# Altium schematic sheet motherboard.SchDoc
size A3; SheetNumber: 1; SheetTotal: 1
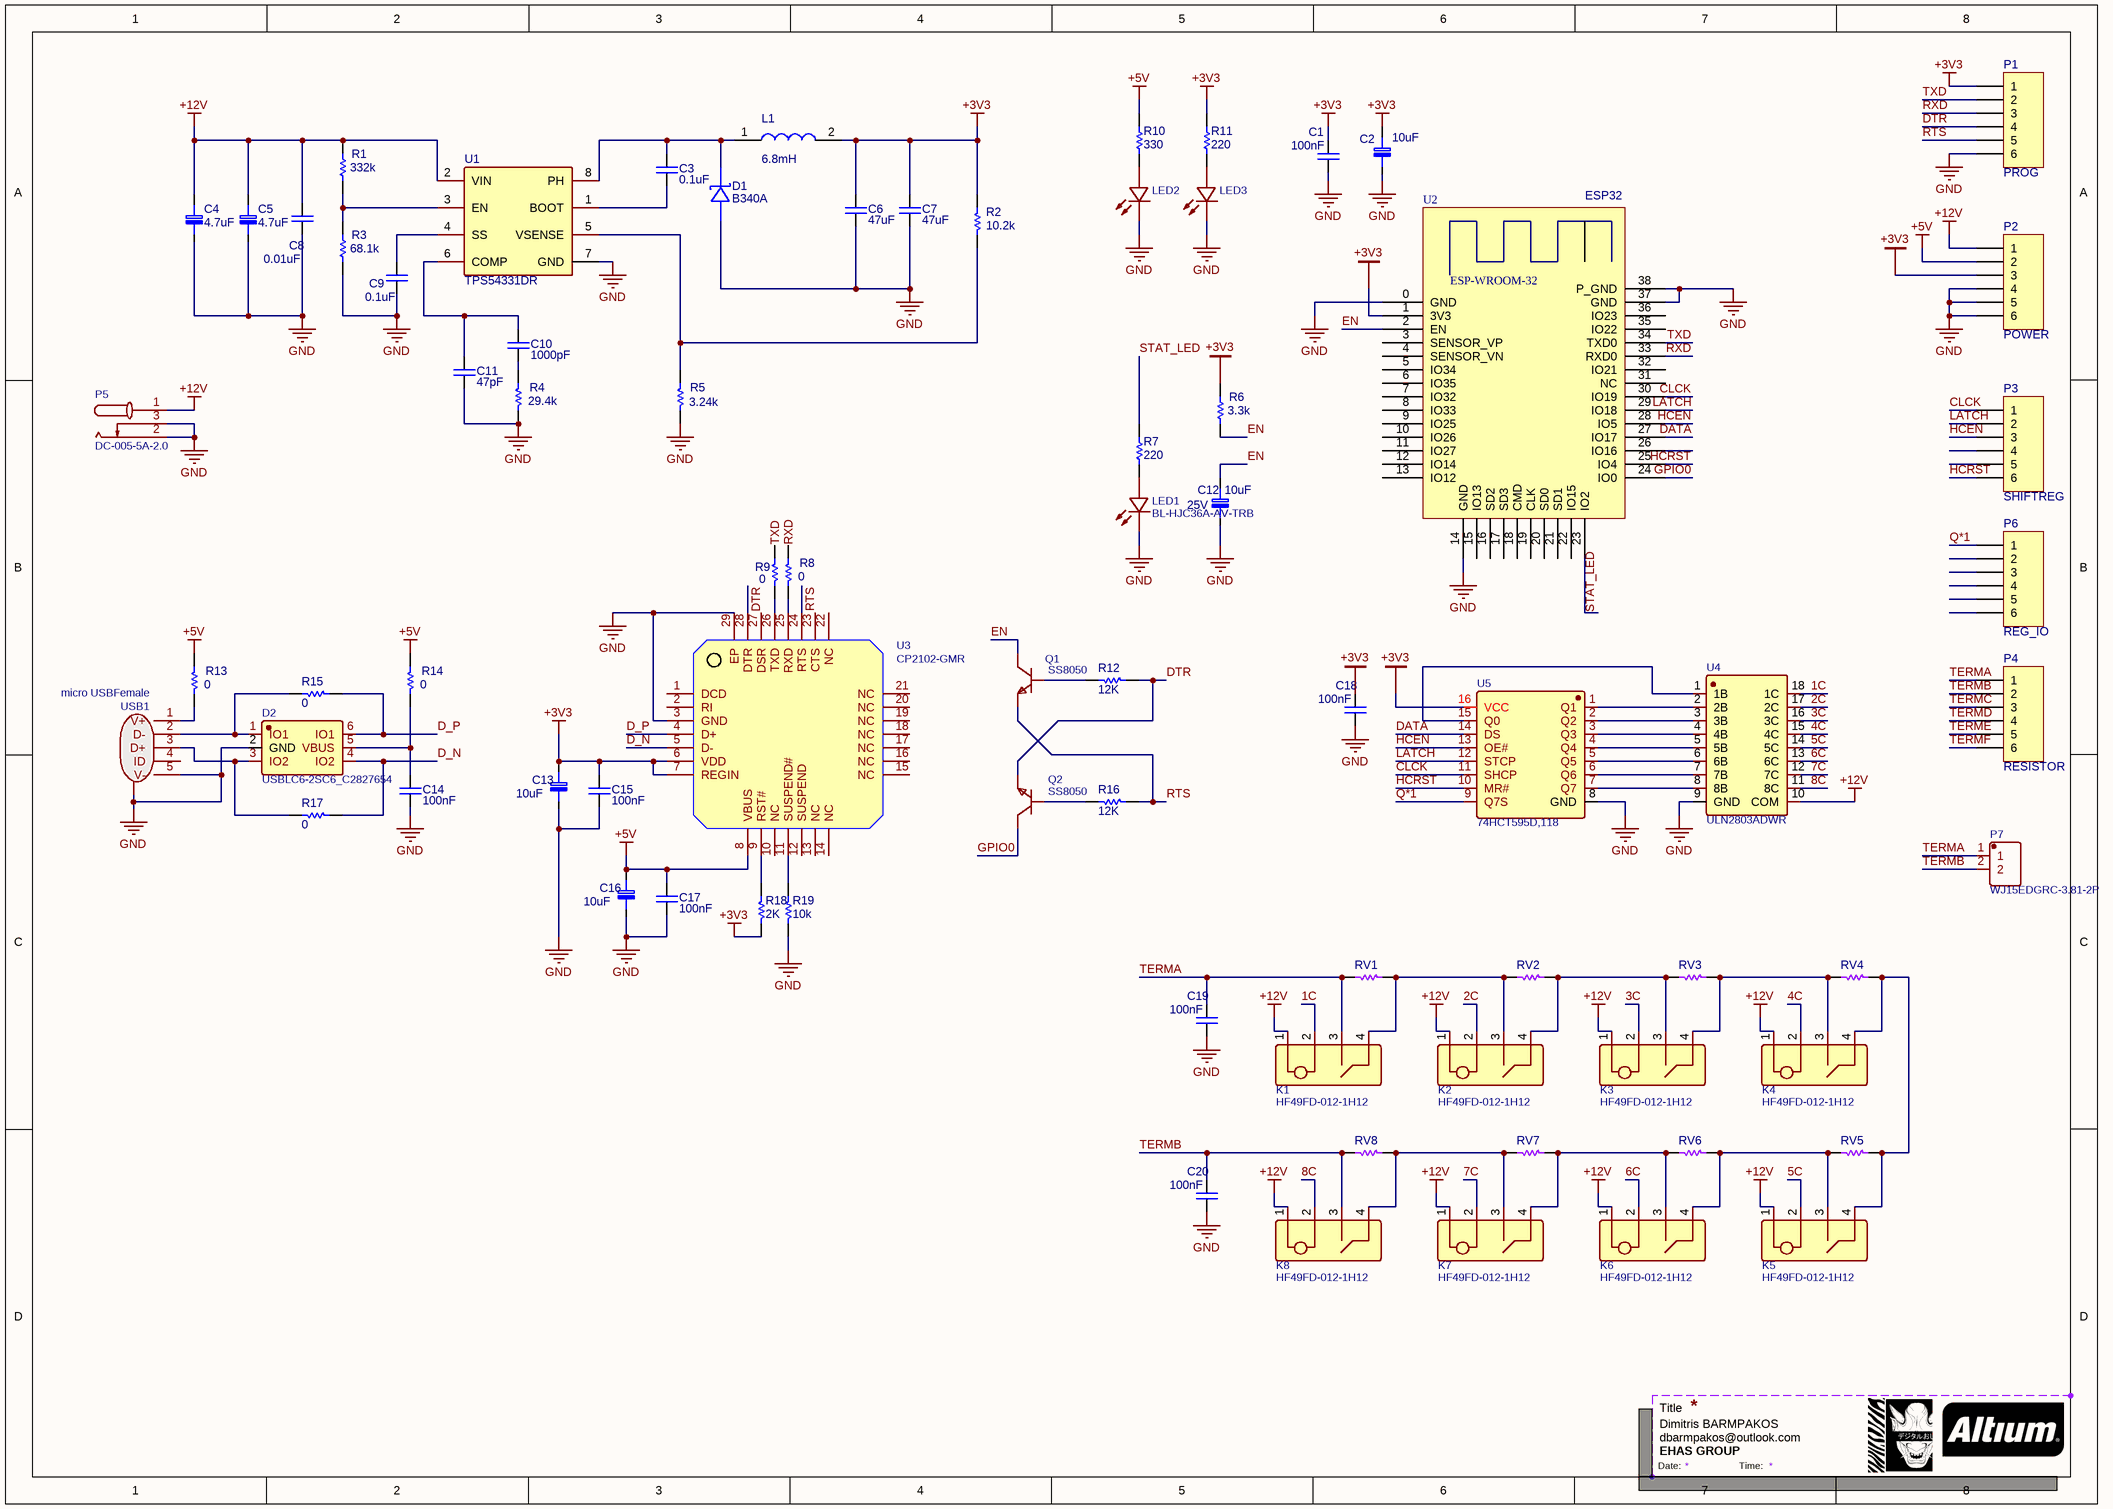
[diagram p0: motherboard.SchDoc]

## Parts
C1  100nF  [CAP_0603]
C2  Capacitance: 10uF  [CAP SMD 6.3X7.7]  (hidden comment: 22uF 63V)
C3  0.1uF  [CAP_0603_3D]
C4  4.7uF  [CAP-SMD_BD6.3-L6.6-W6.6-LS7.2-R-RD]
C5  Capacitance: 4.7uF  [CAP-SMD_BD6.3-L6.6-W6.6-LS7.2-R-RD]  (hidden comment: 22uF 63V)
C6  47uF  [CAP_0603_3D]
C7  47uF  [CAP_0603_3D]
C8  0.01uF  [CAP_0603_3D]
C9  0.1uF  [CAP_0603_3D]
C10  1000pF  [CAP_0603_3D]
C11  47pF  [CAP_0603_3D]
C12  Capacitance: 10uF  Voltage Rating: 25V  [CAP SMD 6.3X7.7]  (hidden comment: 22uF 63V)
C13  Capacitance: 10uF  [CAP-SMD_BD6.3-L6.6-W6.6-LS7.2-R-RD]  (hidden comment: 4.7uF)
C14  100nF  [CAP_0603_3D]
C15  100nF  [CAP_0603_3D]
C16  Capacitance: 10uF  [CAP-SMD_BD6.3-L6.6-W6.6-LS7.2-R-RD]  (hidden comment: 4.7uF)
C17  100nF  [CAP_0603_3D]
C18  100nF  [CAP_0603]
C19  100nF  [CAP_0603]
C20  100nF  [CAP_0603]
D1  B340A  [SMA_L4.3-W2.6-LS5.2-RD]
D2  USBLC6-2SC6_C2827654  [SOT-23-6_L2.9-W1.6-P0.95-LS2.8-BL]
K1  HF49FD-012-1H12  [RELAY-TH_HF49FD-0XX-1H12]
K2  HF49FD-012-1H12  [RELAY-TH_HF49FD-0XX-1H12]
K3  HF49FD-012-1H12  [RELAY-TH_HF49FD-0XX-1H12]
K4  HF49FD-012-1H12  [RELAY-TH_HF49FD-0XX-1H12]
K5  HF49FD-012-1H12  [RELAY-TH_HF49FD-0XX-1H12]
K6  HF49FD-012-1H12  [RELAY-TH_HF49FD-0XX-1H12]
K7  HF49FD-012-1H12  [RELAY-TH_HF49FD-0XX-1H12]
K8  HF49FD-012-1H12  [RELAY-TH_HF49FD-0XX-1H12]
L1  6.8mH  [L_4018]
LED1  BL-HJC36A-AV-TRB  [LED0603-RD_ORANGE]
LED2  BL-HJC36A-AV-TRB  [LED0603-RD_ORANGE]  (value not drawn)
LED3  BL-HJC36A-AV-TRB  [LED0603-RD_ORANGE]  (value not drawn)
P1  PROG  [HDR1X6]
P2  POWER  [HDR1X6]
P3  SHIFTREG  [HDR1X6]
P4  RESISTOR  [HDR1X6]
P5  DC-005-5A-2.0  [DC-IN-TH_DC-005-5A-2.0]
P6  REG_IO  [HDR1X6]
P7  WJ15EDGRC-3.81-2P  [CONN-TH_2P-P3.81_WJ15EDGRC-3.81-2P]
Q1  SS8050  [SOT-23-3_L2.9-W1.3-P1.90-LS2.4-BR]
Q2  SS8050  [SOT-23-3_L2.9-W1.3-P1.90-LS2.4-BR]
R1  Resistance: 332k  [R0603]  (hidden comment: Res1)
R2  Resistance: 10.2k  [R0603]  (hidden comment: Res1)
R3  Resistance: 68.1k  [R0603]  (hidden comment: Res1)
R4  Resistance: 29.4k  [R0603]  (hidden comment: Res1)
R5  Resistance: 3.24k  [R0603]  (hidden comment: Res1)
R6  Resistance: 3.3k  [R0603]  (hidden comment: Res1)
R7  Resistance: 220  [R0603]  (hidden comment: Res1)
R8  Resistance: 0  [R0603]  (hidden comment: Res1)
R9  Resistance: 0  [R0603]  (hidden comment: Res1)
R10  Resistance: 330  [R0603]  (hidden comment: Res1)
R11  Resistance: 220  [R0603]  (hidden comment: Res1)
R12  Resistance: 12K  [R0603]  (hidden comment: Res1)
R13  Resistance: 0  [R0603]  (hidden comment: Res1)
R14  Resistance: 0  [R0603]  (hidden comment: Res1)
R15  Resistance: 0  [R0603]  (hidden comment: Res1)
R16  Resistance: 12K  [R0603]  (hidden comment: Res1)
R17  Resistance: 0  [R0603]  (hidden comment: Res1)
R18  Resistance: 2K  [R0603]  (hidden comment: Res1)
R19  Resistance: 10k  [R0603]  (hidden comment: Res1)
RV1  RV  [RES_PLACEHOLDER]  (value not drawn)
RV2  RV  [RES_PLACEHOLDER]  (value not drawn)
RV3  RV  [RES_PLACEHOLDER]  (value not drawn)
RV4  RV  [RES_PLACEHOLDER]  (value not drawn)
RV5  RV  [RES_PLACEHOLDER]  (value not drawn)
RV6  RV  [RES_PLACEHOLDER]  (value not drawn)
RV7  RV  [RES_PLACEHOLDER]  (value not drawn)
RV8  RV  [RES_PLACEHOLDER]  (value not drawn)
U1  TPS54331DR  [SOIC-8_L5.0-W4.0-P1.27-LS6.0-BL]
U2  ESP32  [ESP32_WROOM]
U3  CP2102-GMR  [WQFN-28_L5.0-W5.0-P0.50-BL-EP3.2]
U4  ULN2803ADWR  [SOIC-18_L11.6-W7.5-P1.27-LS10.3-BL]
U5  74HCT595D,118  [SOIC-16_L9.9-W3.9-P1.27-LS6.0-BL]
USB1  micro USBFemale  [MICRO-USB-SMD_5P-P0.65-H-F_C10418]

## Nets
+3V3: C1.1 C2.1 C6.1 C7.1 C13.1 C15.1 C18.1 L1.2 P1.1 P2.3 R2.1 R6.1 R11.2 R18.1 U2.1(3V3) U3.6(VDD) U3.7(REGIN) U5.16(VCC)
+5V: C16.1 C17.1 P2.2 R10.2 R13.1 R14.1 U3.8(VBUS)
+12V: C4.1 C5.1 C8.1 K1.1 K2.1 K3.1 K4.1 K5.1 K6.1 K7.1 K8.1 P2.1 P5.1 R1.1 U1.2(VIN) U4.10(COM)
GND: C1.2 C2.2 C4.2 C5.2 C6.2 C7.2 C8.2 C9.2 C11.2 C12.2 C13.2 C14.2 C15.2 C16.2 C17.2 C18.2 C19.2 C20.2 D1.2(A) D2.2(GND) LED1.1(K) LED2.1(K) LED3.1(K) P1.6 P2.4 P2.5 P2.6 P5.2 P5.3 R3.2 R4.2 R5.2 R19.1 U1.7(GND) U2.0(GND) U2.14(GND) U2.37(GND) U2.38(P_GND) U3.3(GND) U3.29(EP) U4.9(GND) U5.8(GND) USB1.0(MTN) USB1.5(V-)
1C: K1.2 U4.18(1C)
2C: K2.2 U4.17(2C)
3C: K3.2 U4.16(3C)
4C: K4.2 U4.15(4C)
5C: K5.2 U4.14(5C)
6C: K6.2 U4.13(6C)
7C: K7.2 U4.12(7C)
8C: K8.2 U4.11(8C)
CLCK: P3.1 U2.30(IO19) U5.11(SHCP)
D_N: D2.4(IO2) R17.2 U3.5(D-)
D_P: D2.6(IO1) R15.2 U3.4(D+)
DATA: U2.27(IO17) U5.14(DS)
DTR: P1.4 Q2.2(E) R12.2 U3.28(DTR)
EN: C12.1 Q1.3(C) R6.2 U2.2(EN)
GPIO0: Q2.3(C) U2.24(IO0)
HCEN: P3.3 U2.28(IO5) U5.13(OE#)
HCRST: P3.6 U2.25(IO4) U5.10(MR#)
LATCH: P3.2 U2.29(IO18) U5.12(STCP)
Q*1: P6.1 U5.9(Q7S)
RTS: P1.5 Q1.2(E) R16.2 U3.24(RTS)
RXD: P1.3 R8.1 U2.33(RXD0)
STAT_LED: R7.2 U2.23(IO2)
TERMA: C19.1 K1.3 P4.1 P7.1 RV1.2
TERMB: C20.1 K8.3 P4.2 P7.2 RV8.2
TERMC: P4.3
TERMD: P4.4
TERME: P4.5
TERMF: P4.6
TXD: P1.2 R9.1 U2.34(TXD0)
NetC3_1: C3.1 D1.1(K) L1.1 U1.8(PH)
NetC3_2: C3.2 U1.1(BOOT)
NetC9_1: C9.1 U1.4(SS)
NetC10_1: C10.1 C11.1 U1.6(COMP)
NetC10_2: C10.2 R4.1
NetC14_1: C14.1 D2.5(VBUS) R14.2
NetD2_1: D2.1(IO1) R15.1 USB1.2(D-)
NetD2_3: D2.3(IO2) R17.1 USB1.3(D+)
NetK1_4: K1.4 K2.3 RV1.1 RV2.2
NetK2_4: K2.4 K3.3 RV2.1 RV3.2
NetK3_4: K3.4 K4.3 RV3.1 RV4.2
NetK4_4: K4.4 K5.4 RV4.1 RV5.1
NetK5_3: K5.3 K6.4 RV5.2 RV6.1
NetK6_3: K6.3 K7.4 RV6.2 RV7.1
NetK7_3: K7.3 K8.4 RV7.2 RV8.1
NetLED1_2: LED1.2(A) R7.1
NetLED2_2: LED2.2(A) R10.1
NetLED3_2: LED3.2(A) R11.1
NetQ1_1: Q1.1(B) R12.1
NetQ2_1: Q2.1(B) R16.1
NetR1_2: R1.2 R3.1 U1.3(EN)
NetR2_2: R2.2 R5.1 U1.5(VSENSE)
NetR8_2: R8.2 U3.25(RXD)
NetR9_2: R9.2 U3.26(TXD)
NetR13_2: R13.2 USB1.1(V+)
NetR18_2: R18.2 U3.9(RST#)
NetR19_2: R19.2 U3.11(SUSPEND#)
NetU4_1: U4.1(1B) U5.15(Q0)
NetU4_2: U4.2(2B) U5.1(Q1)
NetU4_3: U4.3(3B) U5.2(Q2)
NetU4_4: U4.4(4B) U5.3(Q3)
NetU4_5: U4.5(5B) U5.4(Q4)
NetU4_6: U4.6(6B) U5.5(Q5)
NetU4_7: U4.7(7B) U5.6(Q6)
NetU4_8: U4.8(8B) U5.7(Q7)

Not connected (* = marked no-connect by the designer): P3 4 5; P6 2 3 4 5 6; U2 3(SENSOR_VP) 4(SENSOR_VN) 5(IO34) 6(IO35) 7(IO32) 8(IO33) 9(IO25) 10(IO26) 11(IO27) 12(IO14) 13(IO12) 15(IO13) 16(SD2) 17(SD3) 18(CMD) 19(CLK) 20(SD0) 21(SD1) 22(IO15) 26(IO16) 31(NC) 32(IO21) 35(IO22) 36(IO23); U3 1(DCD) 2(RI) 10(NC) 12(SUSPEND) 13(NC) 14(NC) 15(NC) 16(NC) 17(NC) 18(NC) 19(NC) 20(NC) 21(NC) 22(NC) 23(CTS) 27(DSR); USB1 4(ID)

## Notes on the sheet
- Title
- Dimitris BARMPAKOS
- dbarmpakos@outlook.com
- EHAS GROUP
- Date:
- Time:
- (in symbol ESP 32) ESP-WROOM-32

## Library data of the parts
C1 C18-C20 = CAP - CER 0.1UF 25V X7R 0805: CAP CER 0.1UF 50V X7R 0603; Manufacturer: FH(Guangdong Fenghua Advanced Tech); Manufacturer Part Number: 0603F104M500NT; Pricing 1: 1=0,10000, 10=0,04400, 50=0,02420, 100=0,01980, 500=0,01412, 1000=0,01110 (USD); Case/Package: 0603; Capacitance: 100nF; Voltage Rating: 50V; Voltage: 50V; Length: 1.6mm; Width: 0.031inch; Height: 0.8mm; Thickness: 0.035inch; Depth: 0.8mm; Supplier 1: JLCPCB; Supplier Part Number 1: C42998
C2 = CAP POL SMD: CAP ALUM 22UF 20% 25V SMD; Manufacturer: Nichicon; Manufacturer Part Number: UWX1E220MCL1GB; Dielectric Material: Aluminium; Ripple Current: 42mA; Voltage Rating: ?V; Polarity: Polar; Leakage Current: 3uA; Life (Hours): 2000Hour; Dissipation Factor: 0.14%; Supplier 1: Digi-Key; Supplier Part Number 1: 493-2109-1-ND; RoHS: Yes; Category: Aluminum Electrolytic Capacitors; Stock 1: 5009; Pricing 1: 1=0,36000, 10=0,25200, 50=0,17620, 100=0,15110, 500=0,11334 (USD); Mount: Surface Mount; Case/Package: SMD/SMT; Weight: 0.01lb; Contact Plating: Tin; Min Operating Temperature: -40°C; Max Operating Temperature: 85°C; Tolerance: 20%; Package Quantity: 1000; Packaging: Tape and Reel; Ripple Current (AC): 42mA; Voltage Rating (DC): 25V; Termination: SMD/SMT; Voltage: 25V; Series: WX; Construction: Cylindrical; Diameter: 6.3mm; Length: 5.4mm; Width: 0.25inch; Height: 5.4mm; Height - Seated (Max): 0.213inch; Lead Pitch: 2.2mm; Radiation Hardening: No; REACH SVHC: No SVHC; Lead Free: Lead Free; RoHS Compliant: Yes; ComponentLink1URL: https://datasheet.ciiva.com/96/e-wx-96336.pdf?src-supplier=Digi-Key; ComponentLink1Description: https://datasheet.ciiva.com/96/e-wx-96336.pdf?src-supplier=Digi-Key; ComponentLink2URL: https://datasheet.ciiva.com/16352/e-wx-16352999.pdf?src-supplier=Future+Electronics; ComponentLink2Description: https://datasheet.ciiva.com/16352/e-wx-16352999.pdf?src-supplier=Future+Electronics; ComponentLink3URL: https://datasheet.ciiva.com/28640/e-wx-28640455.pdf?src-supplier=Element14; ComponentLink3Description: https://datasheet.ciiva.com/28640/e-wx-28640455.pdf?src-supplier=Element14; ComponentLink4URL: https://datasheet.ciiva.com/17529/e-wx-17529096.pdf?src-supplier=Avnet+Europe; ComponentLink4Description: https://datasheet.ciiva.com/17529/e-wx-17529096.pdf?src-supplier=Avnet+Europe; ComponentLink5URL: https://datasheet.ciiva.com/7851/59577-7851769.pdf?src-supplier=Element14; ComponentLink5Description: https://datasheet.ciiva.com/7851/59577-7851769.pdf?src-supplier=Element14; ComponentLink6URL: https://datasheet.ciiva.com/11687/e-wx-11687963.pdf?src-supplier=Avnet; ComponentLink6Description: https://datasheet.ciiva.com/11687/e-wx-11687963.pdf?src-supplier=Avnet; ComponentLink7URL: https://datasheet.ciiva.com/96/e-wx-96334.pdf?src-supplier=Digi-Key; ComponentLink7Description: https://datasheet.ciiva.com/96/e-wx-96334.pdf?src-supplier=Digi-Key; ComponentLink8URL: https://datasheet.ciiva.com/5361/e-wx-11809-5361166.pdf?src-supplier=Mouser; ComponentLink8Description: https://datasheet.ciiva.com/5361/e-wx-11809-5361166.pdf?src-supplier=Mouser; ComponentLink9URL: https://datasheet.ciiva.com/96/e-wx-96335.pdf?src-supplier=Digi-Key; ComponentLink9Description: https://datasheet.ciiva.com/96/e-wx-96335.pdf?src-supplier=Digi-Key
C3 C6-C11 C14 C15 C17 = Cap 22pF: CAP CER 0.1uF 50V C0G/NPO 0603; Manufacturer: Yageo; Manufacturer Part Number: CC0603JRNPO9BN220; Product Training Modules: Multilayer Ceramic Capacitors; Featured Product: Commodity Multilayer Ceramic Capacitors – CC Series; Capacitance: 22pF; Tolerance: ±5%; Temperature Coefficient: C0G, NP0; Online Catalog: CC Series; Other Names: 311-1062-6 311-1280-6 311-1280-6-ND; Supplier 1: Mouser; Stock 1: 92315; Pricing 1: 1=0.1, 10=0.041, 100=0.014, 1000=0.011, 4000=0.008, 8000=0.007 (USD); Standard Package: 1; Category: Capacitors; Family: Ceramic Capacitors; Series: CC; Packaging: Digi-Reel®; Voltage - Rated: 50V; Mounting Type: Surface Mount, MLCC; Operating Temperature: -55°C ~ 125°C; Applications: General Purpose; Ratings: -; Package / Case: 0603 (1608 Metric); Size / Dimension: 0.063" L x 0.031" W (1.60mm x 0.80mm); Height - Seated (Max): -; Thickness (Max): 0.035" (0.90mm); Lead Spacing: -; Features: -; Lead Style: -; ComponentLink1URL: http://www.farnell.com/datasheets/2213336.pdf?src-supplier=Element14; ComponentLink1Description: http://www.farnell.com/datasheets/2213336.pdf?src-supplier=Element14; ComponentLink2URL: http://www.yageo.com/documents/recent/UPY-GP_NP0_16V-to-50V_16.pdf?src-supplier=Digi-Key; ComponentLink2Description: http://www.yageo.com/documents/recent/UPY-GP_NP0_16V-to-50V_16.pdf?src-supplier=Digi-Key; ComponentLink3URL: http://www.farnell.com/datasheets/1443161.pdf?src-supplier=Element14; ComponentLink3Description: http://www.farnell.com/datasheets/1443161.pdf?src-supplier=Element14; ComponentLink4URL: http://www.yageo.com/documents/recent/UPY-GP_NP0_16V-to-50V_8.pdf?src-supplier=Avnet; ComponentLink4Description: http://www.yageo.com/documents/recent/UPY-GP_NP0_16V-to-50V_8.pdf?src-supplier=Avnet; ComponentLink5URL: http://www.yageo.com/documents/recent/UPY-GP_NP0_16V-to-50V_8.pdf?src-supplier=Avnet+Europe; ComponentLink5Description: http://www.yageo.com/documents/recent/UPY-GP_NP0_16V-to-50V_8.pdf?src-supplier=Avnet+Europe; Supplier Part Number 1: 603-CC603JRNPO9BN220
C4 C5 C13 C16 = CAP POL SMD: CAP ALUM 22UF 20% 25V SMD; Manufacturer: Nichicon; Manufacturer Part Number: UWX1E220MCL1GB; Dielectric Material: Aluminium; Ripple Current: 42mA; Polarity: Polar; Leakage Current: 3uA; Life (Hours): 2000Hour; Dissipation Factor: 0.14%; Supplier 1: Digi-Key; Supplier Part Number 1: 493-2109-1-ND; RoHS: Yes; Category: Aluminum Electrolytic Capacitors; Stock 1: 5009; Pricing 1: 1=0,36000, 10=0,25200, 50=0,17620, 100=0,15110, 500=0,11334 (USD); Mount: Surface Mount; Case/Package: SMD/SMT; Weight: 0.01lb; Contact Plating: Tin; Min Operating Temperature: -40°C; Max Operating Temperature: 85°C; Tolerance: 20%; Package Quantity: 1000; Packaging: Tape and Reel; Ripple Current (AC): 42mA; Voltage Rating (DC): 25V; Termination: SMD/SMT; Voltage: 25V; Series: WX; Construction: Cylindrical; Diameter: 6.3mm; Length: 5.4mm; Width: 0.25inch; Height: 5.4mm; Height - Seated (Max): 0.213inch; Lead Pitch: 2.2mm; Radiation Hardening: No; REACH SVHC: No SVHC; Lead Free: Lead Free; RoHS Compliant: Yes; ComponentLink1URL: https://datasheet.ciiva.com/96/e-wx-96336.pdf?src-supplier=Digi-Key; ComponentLink1Description: https://datasheet.ciiva.com/96/e-wx-96336.pdf?src-supplier=Digi-Key; ComponentLink2URL: https://datasheet.ciiva.com/16352/e-wx-16352999.pdf?src-supplier=Future+Electronics; ComponentLink2Description: https://datasheet.ciiva.com/16352/e-wx-16352999.pdf?src-supplier=Future+Electronics; ComponentLink3URL: https://datasheet.ciiva.com/28640/e-wx-28640455.pdf?src-supplier=Element14; ComponentLink3Description: https://datasheet.ciiva.com/28640/e-wx-28640455.pdf?src-supplier=Element14; ComponentLink4URL: https://datasheet.ciiva.com/17529/e-wx-17529096.pdf?src-supplier=Avnet+Europe; ComponentLink4Description: https://datasheet.ciiva.com/17529/e-wx-17529096.pdf?src-supplier=Avnet+Europe; ComponentLink5URL: https://datasheet.ciiva.com/7851/59577-7851769.pdf?src-supplier=Element14; ComponentLink5Description: https://datasheet.ciiva.com/7851/59577-7851769.pdf?src-supplier=Element14; ComponentLink6URL: https://datasheet.ciiva.com/11687/e-wx-11687963.pdf?src-supplier=Avnet; ComponentLink6Description: https://datasheet.ciiva.com/11687/e-wx-11687963.pdf?src-supplier=Avnet; ComponentLink7URL: https://datasheet.ciiva.com/96/e-wx-96334.pdf?src-supplier=Digi-Key; ComponentLink7Description: https://datasheet.ciiva.com/96/e-wx-96334.pdf?src-supplier=Digi-Key; ComponentLink8URL: https://datasheet.ciiva.com/5361/e-wx-11809-5361166.pdf?src-supplier=Mouser; ComponentLink8Description: https://datasheet.ciiva.com/5361/e-wx-11809-5361166.pdf?src-supplier=Mouser; ComponentLink9URL: https://datasheet.ciiva.com/96/e-wx-96335.pdf?src-supplier=Digi-Key; ComponentLink9Description: https://datasheet.ciiva.com/96/e-wx-96335.pdf?src-supplier=Digi-Key
  C4: Capacitance: 4.7uF
C12 = CAP 22UF 63V SMD: CAP ALUM 22UF 20% 25V SMD; Manufacturer: Nichicon; Manufacturer Part Number: UWX1E220MCL1GB; Dielectric Material: Aluminium; Ripple Current: 42mA; Polarity: Polar; Leakage Current: 3uA; Life (Hours): 2000Hour; Dissipation Factor: 0.14%; Supplier 1: Digi-Key; Supplier Part Number 1: 493-2109-1-ND; RoHS: Yes; Category: Aluminum Electrolytic Capacitors; Stock 1: 5009; Pricing 1: 1=0,36000, 10=0,25200, 50=0,17620, 100=0,15110, 500=0,11334 (USD); Mount: Surface Mount; Case/Package: SMD/SMT; Weight: 0.01lb; Contact Plating: Tin; Min Operating Temperature: -40°C; Max Operating Temperature: 85°C; Tolerance: 20%; Package Quantity: 1000; Packaging: Tape and Reel; Ripple Current (AC): 42mA; Voltage Rating (DC): 25V; Termination: SMD/SMT; Voltage: 25V; Series: WX; Construction: Cylindrical; Diameter: 6.3mm; Length: 5.4mm; Width: 0.25inch; Height: 5.4mm; Height - Seated (Max): 0.213inch; Lead Pitch: 2.2mm; Radiation Hardening: No; REACH SVHC: No SVHC; Lead Free: Lead Free; RoHS Compliant: Yes; ComponentLink1URL: https://datasheet.ciiva.com/96/e-wx-96336.pdf?src-supplier=Digi-Key; ComponentLink1Description: https://datasheet.ciiva.com/96/e-wx-96336.pdf?src-supplier=Digi-Key; ComponentLink2URL: https://datasheet.ciiva.com/16352/e-wx-16352999.pdf?src-supplier=Future+Electronics; ComponentLink2Description: https://datasheet.ciiva.com/16352/e-wx-16352999.pdf?src-supplier=Future+Electronics; ComponentLink3URL: https://datasheet.ciiva.com/28640/e-wx-28640455.pdf?src-supplier=Element14; ComponentLink3Description: https://datasheet.ciiva.com/28640/e-wx-28640455.pdf?src-supplier=Element14; ComponentLink4URL: https://datasheet.ciiva.com/17529/e-wx-17529096.pdf?src-supplier=Avnet+Europe; ComponentLink4Description: https://datasheet.ciiva.com/17529/e-wx-17529096.pdf?src-supplier=Avnet+Europe; ComponentLink5URL: https://datasheet.ciiva.com/7851/59577-7851769.pdf?src-supplier=Element14; ComponentLink5Description: https://datasheet.ciiva.com/7851/59577-7851769.pdf?src-supplier=Element14; ComponentLink6URL: https://datasheet.ciiva.com/11687/e-wx-11687963.pdf?src-supplier=Avnet; ComponentLink6Description: https://datasheet.ciiva.com/11687/e-wx-11687963.pdf?src-supplier=Avnet; ComponentLink7URL: https://datasheet.ciiva.com/96/e-wx-96334.pdf?src-supplier=Digi-Key; ComponentLink7Description: https://datasheet.ciiva.com/96/e-wx-96334.pdf?src-supplier=Digi-Key; ComponentLink8URL: https://datasheet.ciiva.com/5361/e-wx-11809-5361166.pdf?src-supplier=Mouser; ComponentLink8Description: https://datasheet.ciiva.com/5361/e-wx-11809-5361166.pdf?src-supplier=Mouser; ComponentLink9URL: https://datasheet.ciiva.com/96/e-wx-96335.pdf?src-supplier=Digi-Key; ComponentLink9Description: https://datasheet.ciiva.com/96/e-wx-96335.pdf?src-supplier=Digi-Key
D1 = B340A: BOM_Manufacturer: MDD; BOM_Supplier: LCSC; BOM_Manufacturer Part: B340A; BOM_Supplier Part: C64982; BOM_JLCPCB Part Class: Extended Part; spicePre: D; spiceSymbolName: B340A
D2 = USBLC6-2SC6_C2827654: BOM_Manufacturer: TECH PUBLIC(台舟电子); Contributor: LCSC; BOM_Supplier: LCSC; BOM_Supplier Part: C2827654; BOM_Manufacturer Part: USBLC6-2SC6; BOM_JLCPCB Part Class: Extended Part; spicePre: D; spiceSymbolName: USBLC6-2SC6_C2827654
K1-K8 = HF49FD-012-1H12: BOM_Manufacturer: Xiamen Hongfa Electroacoustic; Contributor: LCSC; BOM_Supplier: LCSC; BOM_Supplier Part: C117488; BOM_Manufacturer Part: HF49FD-012-1H12; BOM_JLCPCB Part Class: Extended Part; spicePre: K; spiceSymbolName: HF49FD-012-1H12
L1 = L: C393989
LED1-LED3 = BL-HJC36A-AV-TRB: BOM_Manufacturer: Bright LED Elec; Contributor: LCSC; BOM_Supplier: LCSC; BOM_Supplier Part: C138546; BOM_Manufacturer Part: BL-HJC36A-AV-TRB; BOM_JLCPCB Part Class: Extended Part; spicePre: L; spiceSymbolName: BL-HJC36A-AV-TRB
P1-P4 P6 = Header 6: Header, 6-Pin; System: Connector; LatestRevisionDate: 17-Jul-2002; LatestRevisionNote: Re-released for DXP Platform.; Publisher: Altium Limited
P5 = DC-005-5A-2.0: BOM_Manufacturer: XKB Enterprise; Contributor: LCSC; BOM_Supplier: LCSC; BOM_Supplier Part: C381116; BOM_Manufacturer Part: DC-005-5A-2.0; BOM_JLCPCB Part Class: Extended Part; spicePre: D; spiceSymbolName: DC-005-5A-2.0
P7 = WJ15EDGRC-3.81-2P: C8387; BOM_Manufacturer: ReliaPro; spicePre: X; BOM_Supplier: LCSC; BOM_Manufacturer Part: WJ15EDGRC-3.81-2P; BOM_Supplier Part: C8387; BOM_JLCPCB Part Class: Extended Part; spiceSymbolName: WJ15EDGRC-3.81-2P
Q1 Q2 = SS8050_C2150: BOM_Manufacturer: CJ; BOM_Supplier: LCSC; BOM_Manufacturer Part: SS8050; BOM_Supplier Part: C2150; BOM_JLCPCB Part Class: Basic Part; spicePre: Q; spiceSymbolName: SS8050_C2150
R1-R11 R13-R15 R17-R19 = Res1: Res Thick Film 0603 1M Ohm 1% 0.1W(1/10W) ±100ppm/C Pad SMD T/R; Manufacturer: TE Connectivity; Manufacturer Part Number: CRG0603F1M0; Power Rating: 100mW; Temperature Coefficient: 100ppm/°C; Number of Resistors: 1; Voltage Rating: 50V; Supplier 1: Digi-Key; Supplier Part Number 1: A121559CT-ND; RoHS: Yes; Category: Chip SMD Resistors; Stock 1: 32347; Pricing 1: 1=0,10000, 10=0,02800, 100=0,01130, 1000=0,00506, 2500=0,00439 (USD); Mount: Surface Mount; Case/Package: 0603; Case Code (Imperial): 0603; Weight: 7.1E-05oz; Min Operating Temperature: -55°C; Max Operating Temperature: 125°C; Package Quantity: 5000; Tolerance: 1%; Packaging: Tape and Reel; Resistor Type: Thick Film; Number of Terminations: 2; Max Power Dissipation: 100mW; Termination: Solder; Series: CRG, Neohm; Technology: THICK FILM; Construction: Rectangular; Length: 1.6mm; Width: 0.8mm; Height: 0.45mm; Depth: 0.8mm; Radiation Hardening: No; Military Standard: Not; Lead Free: Lead Free; ELV: Compliant; RoHS Compliant: Yes
R12 R16 = 1: Res Thkflm Anti-sulfurated 0603 100K Ohm 5% SMD; Manufacturer: Panasonic; Manufacturer Part Number: ERJ-U03J104V; Current Rating: 1A; Voltage Rating (DC): 75V; Power Rating: 100mW; Supplier 1: Digi-Key; Supplier Part Number 1: 10-ERJ-U03J104VCT-ND; Category: Chip SMD Resistors; Stock 1: 1856; Pricing 1: 1=0,10000, 10=0,07700, 100=0,02950, 1000=0,01298, 2500=0,01121 (USD); Case/Package: 0603; Weight: 7.1E-05oz; Case Code (Imperial): 0603; Case Code (Metric): 1608; Min Operating Temperature: -55°C; Max Operating Temperature: 155°C; Tolerance: 5%; Voltage Rating: 75V; Packaging: Tape and Reel; Package Quantity: 5000; Resistor Type: Thick Film; Termination: SMD/SMT; Length: 1.6mm; Width: 0.8mm; Height: 0.45mm; ComponentLink1URL: http://industrial.panasonic.com/www-cgi/jvcr13pz.cgi?E+PZ+3+AOA0005+ERJS06J821V+7+WW?src-supplier=Mouser; ComponentLink1Description: http://industrial.panasonic.com/www-cgi/jvcr13pz.cgi?E+PZ+3+AOA0005+ERJS06J821V+7+WW?src-supplier=Mouser; ComponentLink2URL: http://datasheet.octopart.com/ERJ-U03J104V-Panasonic-datasheet-61627662.pdf?src-supplier=Newark; ComponentLink2Description: http://datasheet.octopart.com/ERJ-U03J104V-Panasonic-datasheet-61627662.pdf?src-supplier=Newark; ComponentLink3URL: http://datasheet.octopart.com/ERJ-U03J104V-Panasonic-datasheet-33006993.pdf?src-supplier=Newark; ComponentLink3Description: http://datasheet.octopart.com/ERJ-U03J104V-Panasonic-datasheet-33006993.pdf?src-supplier=Newark; ComponentLink4URL: http://datasheet.octopart.com/ERJ-U03J104V-Panasonic-datasheet-78375410.pdf; ComponentLink4Description: http://datasheet.octopart.com/ERJ-U03J104V-Panasonic-datasheet-78375410.pdf
RV1-RV8 = RV: Placeholder for resistor; Manufacturer: Panasonic; Manufacturer Part Number: ERJ-U03J104V; Current Rating: 1A; Voltage Rating (DC): 75V; Power Rating: 100mW; Tolerance: 5%; Category: Chip SMD Resistors; Stock 1: 1856; Pricing 1: 1=0,10000, 10=0,07700, 100=0,02950, 1000=0,01298, 2500=0,01121 (USD); Case/Package: 0603; Weight: 7.1E-05oz; Case Code (Imperial): 0603; Case Code (Metric): 1608; Min Operating Temperature: -55°C; Max Operating Temperature: 155°C; Voltage Rating: 75V; Packaging: Tape and Reel; Package Quantity: 5000; Resistor Type: Thick Film; Termination: SMD/SMT; Length: 1.6mm; Width: 0.8mm; Height: 0.45mm; ComponentLink1URL: http://industrial.panasonic.com/www-cgi/jvcr13pz.cgi?E+PZ+3+AOA0005+ERJS06J821V+7+WW?src-supplier=Mouser; ComponentLink1Description: http://industrial.panasonic.com/www-cgi/jvcr13pz.cgi?E+PZ+3+AOA0005+ERJS06J821V+7+WW?src-supplier=Mouser; ComponentLink2URL: http://datasheet.octopart.com/ERJ-U03J104V-Panasonic-datasheet-61627662.pdf?src-supplier=Newark; ComponentLink2Description: http://datasheet.octopart.com/ERJ-U03J104V-Panasonic-datasheet-61627662.pdf?src-supplier=Newark; ComponentLink3URL: http://datasheet.octopart.com/ERJ-U03J104V-Panasonic-datasheet-33006993.pdf?src-supplier=Newark; ComponentLink3Description: http://datasheet.octopart.com/ERJ-U03J104V-Panasonic-datasheet-33006993.pdf?src-supplier=Newark; ComponentLink4URL: http://datasheet.octopart.com/ERJ-U03J104V-Panasonic-datasheet-78375410.pdf; ComponentLink4Description: http://datasheet.octopart.com/ERJ-U03J104V-Panasonic-datasheet-78375410.pdf
U1 = TPS54331DR: BOM_Manufacturer: TI; BOM_Supplier: LCSC; BOM_Manufacturer Part: TPS54331DR; BOM_Supplier Part: C9865; BOM_JLCPCB Part Class: Basic Part; spicePre: U; spiceSymbolName: TPS54331DR
U2 = ESP 32
U3 = CP2102-GMR: BOM_Manufacturer: SILICON LABS; BOM_Supplier: LCSC; BOM_Manufacturer Part: CP2102-GMR; BOM_Supplier Part: C6568; BOM_JLCPCB Part Class: Basic Part; spicePre: U; spiceSymbolName: CP2102-GMR
U4 = ULN2803ADWR: BOM_Manufacturer: TI; spicePre: X; BOM_Supplier: LCSC; BOM_Manufacturer Part: ULN2803ADWR; BOM_Supplier Part: C9683; BOM_JLCPCB Part Class: Basic Part; spiceSymbolName: ULN2803ADWR
U5 = 74HCT595D,118: BOM_Manufacturer: Nexperia; Contributor: LCSC; BOM_Supplier: LCSC; BOM_Supplier Part: C282339; BOM_Manufacturer Part: 74HCT595D,118; BOM_JLCPCB Part Class: Extended Part; spicePre: U; spiceSymbolName: 74HCT595D,118
USB1 = micro USBFemale: BOM_Manufacturer: ValuePro; BOM_Supplier: LCSC; BOM_Manufacturer Part: micro USBFemale; BOM_Supplier Part: C10418; BOM_JLCPCB Part Class: Extended Part; spicePre: U; spiceSymbolName: micro USBFemale